# EAGLE design transfer (EAGLE 7.4.0)
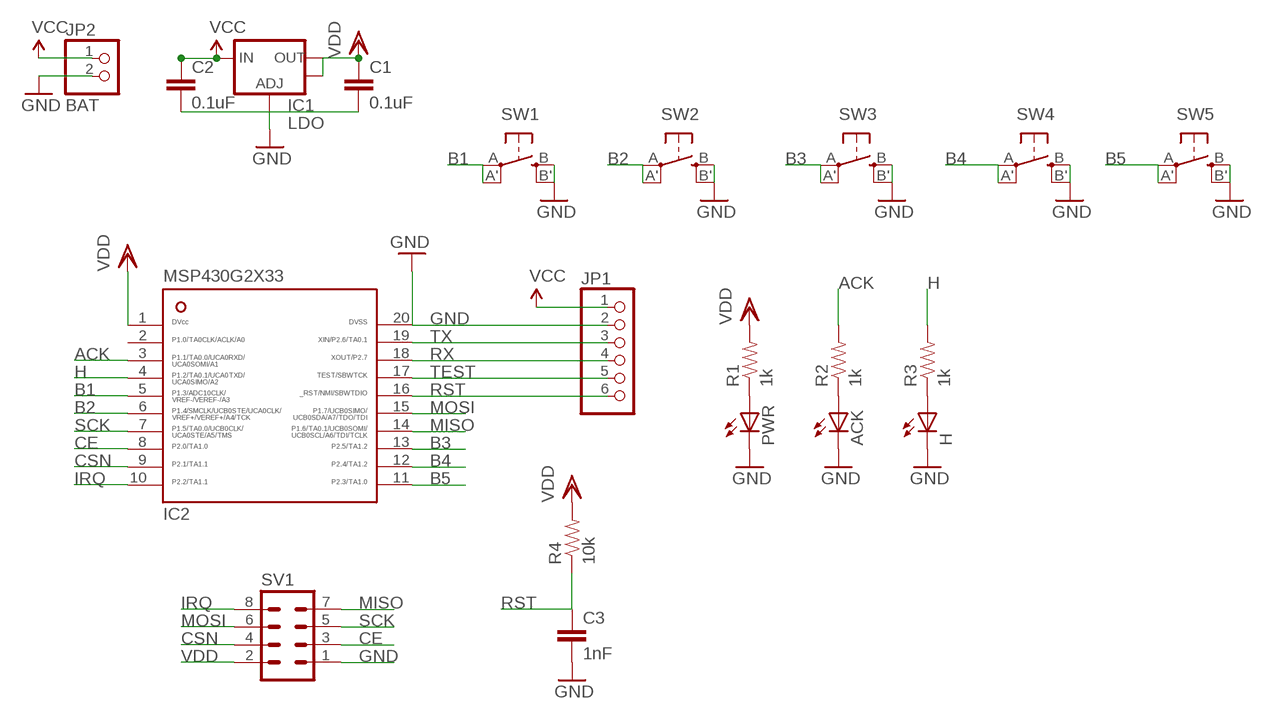
[diagram p0: schematic, sheet 1]

## Parts
ACK  LEDCHIP-LED0805  [CHIP-LED0805]
C1  0.1uF  0.1UF-25V(+80/-20%)(0603)  [0603-CAP]
C2  0.1uF  0.1UF-25V(+80/-20%)(0603)  [0603-CAP]
C3  1nF  0.1UF-25V(+80/-20%)(0603)  [0603-CAP]
H  LEDCHIP-LED0805  [CHIP-LED0805]
IC1  LDO  V_REG_LM1117SOT223  [SOT223]
IC2  MSP430  MSP430G2X33-20PW20  [PW20]
JP1  PINHD-1X6  [1X06]
JP2  BAT  PINHD-1X2  [1X02]
PWR  LEDCHIP-LED0805  [CHIP-LED0805]
R1  1k  0.22OHM1/4W1%(0805)  [0805]
R2  1k  0.22OHM1/4W1%(0805)  [0805]
R3  1k  0.22OHM1/4W1%(0805)  [0805]
R4  10k  0.22OHM1/4W1%(0805)  [0805]
SV1  MA04-2  [MA04-2]
SW1  SPST_TACT-EVQQ2  [EVQ-Q2]
SW2  SPST_TACT-EVQQ2  [EVQ-Q2]
SW3  SPST_TACT-EVQQ2  [EVQ-Q2]
SW4  SPST_TACT-EVQQ2  [EVQ-Q2]
SW5  SPST_TACT-EVQQ2  [EVQ-Q2]

## Nets
ACK: IC2.3 R2.2
B1: IC2.5 SW1.A'(P1) SW1.A(P)
B2: IC2.6 SW2.A'(P1) SW2.A(P)
B3: IC2.13 SW3.A'(P1) SW3.A(P)
B4: IC2.12 SW4.A'(P1) SW4.A(P)
B5: IC2.11 SW5.A'(P1) SW5.A(P)
CE: IC2.8 SV1.3
CSN: IC2.9 SV1.4
GND: ACK.C C1.2 C2.2 C3.2 H.C IC1.1(ADJ) IC2.20 JP1.2 JP2.2 PWR.C SV1.1 SW1.B'(S1) SW1.B(S) SW2.B'(S1) SW2.B(S) SW3.B'(S1) SW3.B(S) SW4.B'(S1) SW4.B(S) SW5.B'(S1) SW5.B(S)
H: IC2.4 R3.2
IRQ: IC2.10 SV1.8
MISO: IC2.14 SV1.7
MOSI: IC2.15 SV1.6
N$6: PWR.A R1.1
N$7: ACK.A R2.1
N$8: H.A R3.1
RST: C3.1 IC2.16 JP1.6 R4.1
RX: IC2.18 JP1.4
SCK: IC2.7 SV1.5
TEST: IC2.17 JP1.5
TX: IC2.19 JP1.3
VCC: C2.1 IC1.3(IN) JP1.1 JP2.1
VDD: C1.1 IC1.2(OUT) IC1.4(OUT) IC2.1 R1.2 R4.2 SV1.2
Unconnected: IC2.2

## Library data of the parts
ACK H PWR = adafruit:LED: LED OSRAM: - CHIPLED LG R971, LG N971, LY N971, LG Q971, LY Q971, LO R971, LY R971 LH N974, LH R974 LS Q976, LO Q976, LY Q976 LO Q996 - Hyper CHIPLED LW Q18S LB Q993, LB Q99A, LB R99A - SideLED LS A670, LO A670, LY A670, LG A670, LP A670 LB A673, LV A673, LT A673, LW A673 LH A674 LY A675 LS A676, LA A676, LO A676, LY A676, LW A676 LS A679, LY A679, LG A679 - Hyper Micro SIDELED® LS Y876, LA Y876, LO Y876, LY Y876 LT Y87S - SmartLED LW L88C, LW L88S LB L89C, LB L89S, LG L890 LS L89K, LO L89K, LY L89K LS L896, LA L896, LO L896, LY L896 - TOPLED LS T670, LO T670, LY T670, LG T670, LP T670 LSG T670, LSP T670, LSY T670, LOP T670, LYG T670 LG T671, LOG T671, LSG T671 LB T673, LV T673, LT T673, LW T673 LH T674 LS T676, LA T676, LO T676, LY T676, LB T676, LH T676, LSB T676, LW T676 LB T67C, LV T67C, LT T67C, LS T67K, LO T67K, LY T67K, LW E67C LS E67B, LA E67B, LO E67B, LY E67B, LB E67C, LV E67C, LT E67C LW T67C LS T679, LY T679, LG T679 LS T770, LO T770, LY T770, LG T770, LP T770 LB T773, LV T773, LT T773, LW T773 LH T774 LS E675, LA E675, LY E675, LS T675 LS T776, LA T776, LO T776, LY T776, LB T776 LHGB T686 LT T68C, LB T68C - Hyper Mini TOPLED® LB M676 - Mini TOPLED Santana® LG M470 LS M47K, LO M47K, LY M47K Source: http://www.osram.convergy.de/
C1 C2 = SparkFun-Capacitors:0.1UF-25V(+80/-20%)(0603): CAP-00810 Ceramic Standard decoupling cap; PROD_ID: CAP-00810
C3 = SparkFun-Capacitors:0.1UF-25V(+80/-20%)(0603): CAP-00810 Ceramic Standard decoupling cap; PROD_ID: CAP-00810; VALUE: 0.1uF
IC1 = SparkFun-PowerIC:V_REG_LM1117: Voltage Regulator LM1117 Standard adjustable voltage regulator but in SMD form. Spark Fun Electronics SKU : COM-00595
IC2 = ti_msp430:MSP430G2X33-20
JP1 = pinhead:PINHD-1X6: PIN HEADER
JP2 = pinhead:PINHD-1X2: PIN HEADER
R1-R4 = SparkFun-Resistors:0.22OHM1/4W1%(0805): RES-09883; PROD_ID: RES-09883; VALUE: 0.22
SV1 = con-lstb:MA04-2: PIN HEADER; OC_FARNELL: unknown; OC_NEWARK: unknown
SW1-SW5 = adafruit:SPST_TACT: SMT 6mm switch, EVQQ2 series http://www.ladyada.net/library/eagle

## Board
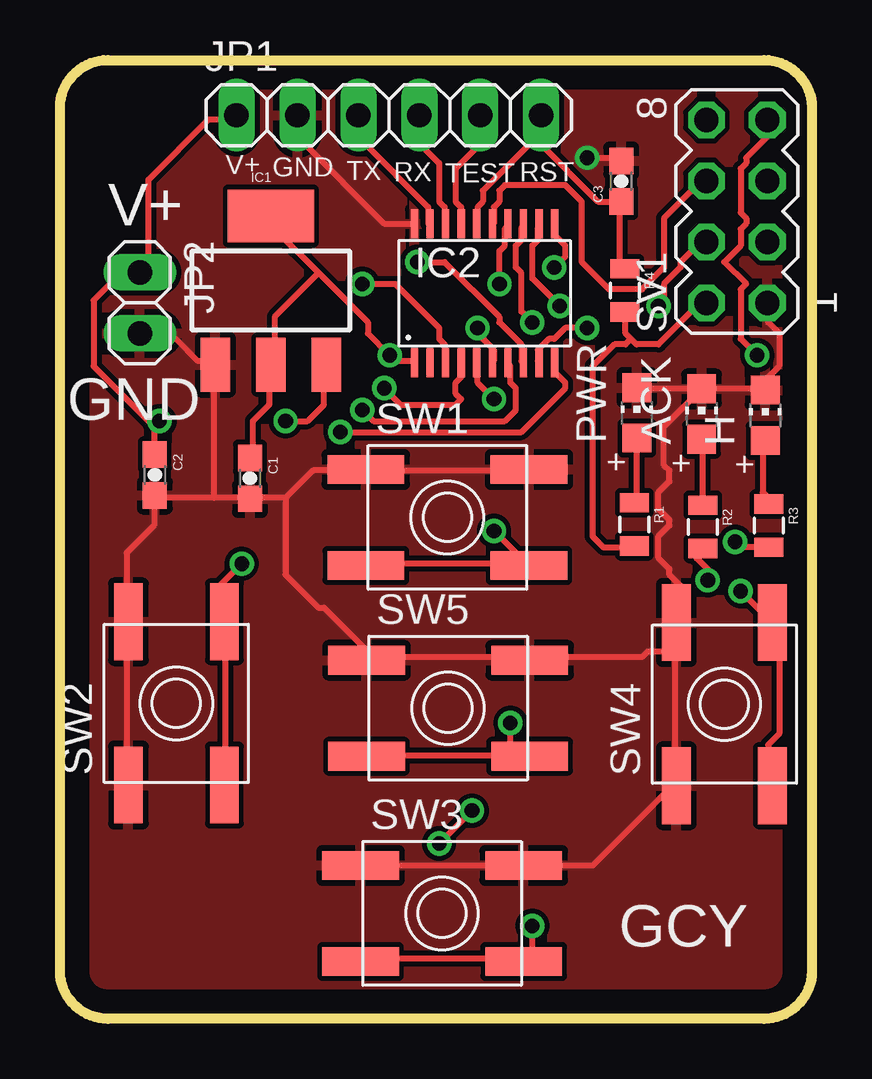
[diagram p1: board, top side]
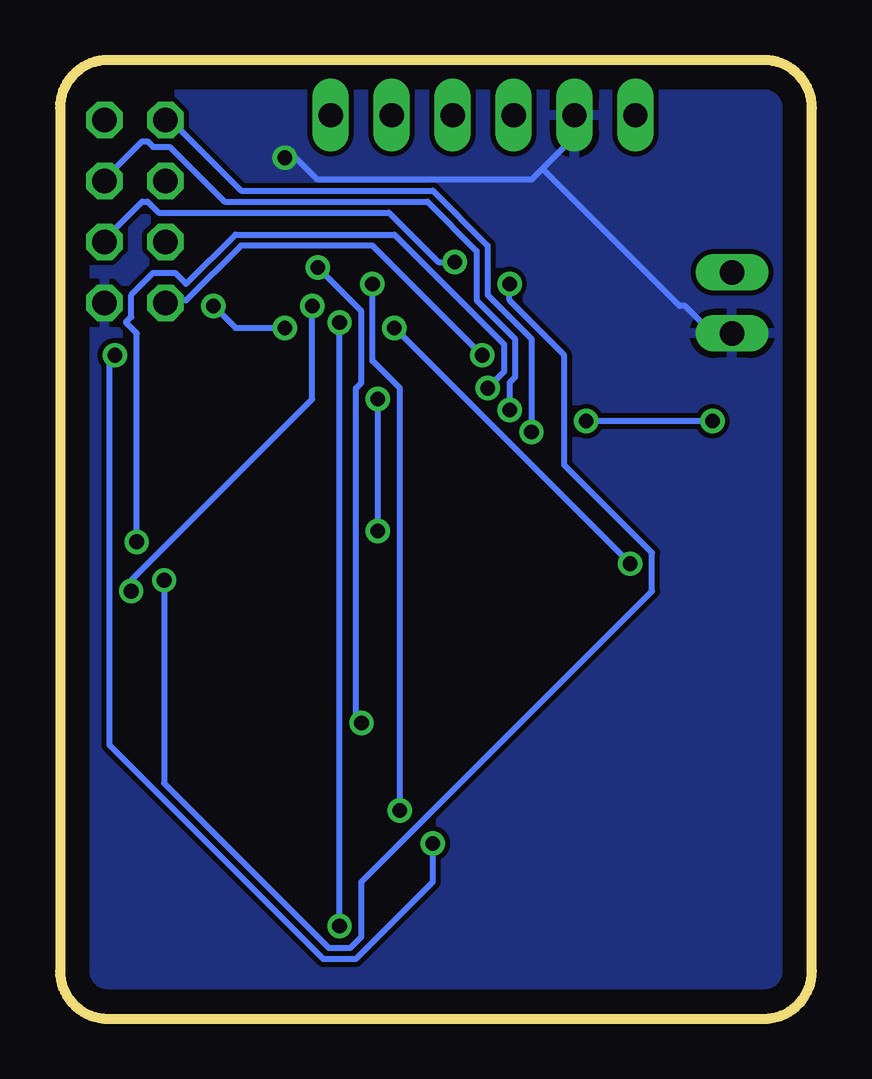
[diagram p2: board, bottom side, seen from below]

Size 31.35 x 39.95 mm. Coordinates in mm from the lower left corner, seen from the top.
Outline: 0,2 0,37.95 arc-90 2,39.95 29.35,39.95 arc-90 31.35,37.95 31.35,2 arc-90 29.35,0 2,0 arc-90 0,2
Copper layers (1*16): Top 0.035mm / dielectric 1.5mm / Bottom 0.035mm
Design rules "default": minimum track width 10mil, minimum drill 24mil, track to track 8mil, track to pad 8mil, pad to pad 8mil, via to via 8mil, smd to smd 8mil, copper to edge 40mil, drill to drill 8mil, minimum pad ring 10mil, minimum via ring 8mil, stop-mask expansion 4mil, vias tented up to drill 0mil, thermal gap 10mil

### Footprints (pad centres in the part's own frame; a part is rotated, then mirrored left to right if it is on the bottom)
CHIP-LED0805 = smd 1.2 x 1.2: A 0,-1.05; C 0,1.05
0603-CAP = smd 1.1 x 1: 1 -0.85,0; 2 0.85,0
SOT223 = smd 1.219 x 2.235: 1 -2.311,-3.099; 2 0,-3.099; 3 2.311,-3.099 | smd 3.6 x 2.2: 4 0,3.099
PW20 = smd 0.3 x 1.2: 1 -2.925,-2.9; 2 -2.275,-2.9; 3 -1.625,-2.9; 4 -0.975,-2.9; 5 -0.325,-2.9; 6 0.325,-2.9; 7 0.975,-2.9; 8 1.625,-2.9; 9 2.275,-2.9; 10 2.925,-2.9; 11 2.925,2.9; 12 2.275,2.9; 13 1.625,2.9; 14 0.975,2.9; 15 0.325,2.9; 16 -0.325,2.9; 17 -0.975,2.9; 18 -1.625,2.9; 19 -2.275,2.9; 20 -2.925,2.9
1X06 = drill 1.016 long: 1 -6.35,0; 2 -3.81,0; 3 -1.27,0; 4 1.27,0; 5 3.81,0; 6 6.35,0
1X02 = drill 1.016 long: 1 -1.27,0; 2 1.27,0
0805 = smd 0.8 x 1.2: 1 -0.9,0; 2 0.9,0
MA04-2 = drill 1.016 octagon: 1 -3.81,-1.27; 2 -3.81,1.27; 3 -1.27,-1.27; 4 -1.27,1.27; 5 1.27,-1.27; 6 1.27,1.27; 7 3.81,-1.27; 8 3.81,1.27
EVQ-Q2 = smd 3.2 x 1.2: A -3.4,-2; A' 3.4,-2; B -3.4,2; B' 3.4,2

### Placement (x,y rotation side)
ACK  26.75,25.2 0 top
C1  7.92,22.52 270 top
C2  3.95,22.66 270 top
C3  23.4,34.9 90 top
H  29.4,25.15 0 top
IC1  8.79,30.35 0 top
IC2  17.7,30.23 0 top
JP1  13.71,37.65 0 top
JP2  3.33,29.83 270 top
PWR  24.05,25.25 0 top
R1  23.95,20.6 270 top
R2  26.8,20.5 270 top
R3  29.55,20.55 270 top
R4  23.55,30.35 270 top
SV1  28.22,33.64 90 top
SW1  16.15,20.89 0 top
SW2  4.85,13.14 90 top
SW3  15.93,4.39 0 top
SW4  27.7,13.11 90 top
SW5  16.18,12.94 0 top

### Tracks (layer width: path | path; a pad name or v marks a point on that pad's centre or on a via)
ACK  (via drill 0.61)
  Top 0.254: v12.61,30.62 13.98,30.62 15.81,28.79 15.81,28.33 16.03,28.1 16.03,27.42 IC2.3 | v27.01,18.27 27.24,18.5 26.55,19.19 26.55,19.42 26.78,19.65 R2.2
  Bottom 0.254: v12.61,30.62 12.61,29.93 10.32,27.65 10.32,23.07 6.66,19.42 6.66,17.82 18.78,5.7 18.78,3.41 19.24,2.96 20.15,2.96 27.01,9.82 v27.01,18.27
B1  (via drill 0.61)
  Top 0.254: v18.09,25.82 17.41,26.5 17.41,27.19 IC2.5 | 19.01,19.42 19.46,18.96 SW1.A' 19.01,19.42 | 19.01,19.42 v18.09,20.33 | 19.01,19.42 18.55,18.96 12.84,18.96 SW1.A
  Bottom 0.254: v18.09,20.33 v18.09,25.82
B2  (via drill 0.61)
  Top 0.254: v17.41,28.79 17.63,28.56 17.63,28.33 18.09,27.88 18.09,27.42 IC2.6 | v7.58,18.96 6.66,18.05 6.66,16.67 SW2.A' 6.89,16.45 6.89,9.82 SW2.A
  Bottom 0.254: v7.58,18.96 v17.41,28.79
B3  (via drill 0.61)
  Top 0.254: v19.69,29.02 19.24,29.48 19.24,31.08 19.01,31.3 19.01,32.22 19.24,32.45 19.24,32.91 IC2.13 | v19.69,3.87 19.69,2.73 19.46,2.5 SW3.A' 19.24,2.5 12.61,2.5 SW3.A
  Bottom 0.254: v19.69,3.87 v19.69,29.02
B4  (via drill 0.61)
  Top 0.254: v20.84,29.7 19.69,30.85 19.69,32.22 19.92,32.45 19.92,32.91 IC2.12 | v28.38,17.82 29.52,16.67 SW4.A' 29.75,16.45 29.98,16.22 29.98,11.87 29.52,11.42 29.52,9.82 SW4.A
  Bottom 0.254: v20.84,29.7 20.84,25.82 28.38,18.27 v28.38,17.82
B5  (via drill 0.61)
  Top 0.254: v20.61,31.3 21.06,31.76 21.06,32.22 20.61,32.68 20.61,32.91 IC2.11 | 18.78,11.42 v18.78,12.33 | 18.78,11.42 19.46,10.73 SW5.A' 18.78,11.42 | 18.78,11.42 18.32,10.96 12.84,10.96 SW5.A
  Bottom 0.254: v20.61,31.3 18.78,29.48 18.78,26.5 19.01,26.27 19.01,12.56 v18.78,12.33
CE  (via drill 0.61)
  Top 0.254: v14.89,31.53 16.03,31.53 18.32,29.25 18.32,29.02 19.24,28.1 19.24,27.42 IC2.8
  Bottom 0.254: v14.89,31.53 15.58,31.53 17.63,33.59 27.24,33.59 27.69,34.05 27.92,34.05 29.52,32.45 SV1.3
CSN  (via drill 0.61)
  Top 0.254: v21.98,28.79 21.06,28.79 20.61,28.33 20.38,28.33 19.92,27.88 19.92,27.42 IC2.9 | v24.95,29.7 25.18,29.93 25.18,30.62 25.87,31.3 25.87,31.53 26.78,32.45 SV1.4
  Bottom 0.254: v21.98,28.79 24.04,28.79 v24.95,29.7
GND  (via drill 0.61)
  Top 0.254: SW3.B 12.61,6.39 19.24,6.39 SW3.B' 19.46,6.39 22.21,6.39 25.64,9.82 | ACK.C 26.55,26.27 24.27,26.27 PWR.C | ACK.C 26.78,26.27 29.29,26.27 H.C 29.52,26.27 29.52,26.73 29.98,27.19 29.98,28.56 29.52,29.02 29.52,29.7 SV1.1 | 25.64,15.3 25.64,16.45 SW4.B' | 25.64,15.3 25.64,9.82 | ACK.C 26.55,26.05 25.18,24.68 25.18,23.07 25.41,22.85 25.41,22.39 24.95,21.93 24.95,21.25 25.41,20.79 25.41,20.56 24.95,20.1 24.95,19.19 25.41,18.73 25.41,18.5 25.87,18.05 25.87,16.67 SW4.B' | 25.64,9.82 SW4.B | 25.64,15.3 24.49,15.3 24.27,15.07 19.69,15.07 SW5.B' 19.46,15.07 12.84,15.07 SW5.B 12.61,15.07 12.61,15.53 11.01,17.13 10.78,17.13 9.41,18.5 9.41,21.7 | 25.64,15.3 SW4.B' | v21.98,35.88 23.35,35.88 C3.2 | IC2.20 14.66,33.13 13.52,33.13 10.09,36.56 10.09,37.48 JP1.2 | SW2.B 2.78,9.82 2.78,16.45 SW2.B' 2.78,16.67 2.78,19.42 3.92,20.56 3.92,21.7 C2.2 4.15,21.7 6.43,21.7 | JP2.2 3.46,28.33 4.83,28.33 5.75,27.42 6.43,27.42 IC1.1 6.43,27.19 6.43,21.7 | 6.43,21.7 7.81,21.7 C1.2 8.03,21.7 9.41,21.7 | 9.41,21.7 10.55,22.85 12.61,22.85 SW1.B 12.84,22.85 19.46,22.85 SW1.B'
  Bottom 0.254: v21.98,35.88 21.52,35.88 20.61,34.96 11.69,34.96 11.23,35.42 | 11.23,35.42 10.09,36.56 10.09,37.48 JP1.2 | 11.23,35.42 5.52,29.7 5.29,29.7 4.15,28.56 3.46,28.56 JP2.2
  pour Bottom: 1.7,39.9 29.4,39.9 arc-90 31.4,37.9 31.4,2.2 31.4,2 arc-90 29.4,0 2.2,0 2,0 arc-90 0,2 0,38.2 arc-90
  pour Top: -0.05,1.9 arc90 1.95,-0.1 29.1,-0.1 29.35,-0.1 arc90 31.35,1.9 31.35,38.1 arc90 29.5,39.95 2.2,39.95 1.9,39.95 arc90 0,38.1 0,38.25
H  (via drill 0.61)
  Top 0.254: v13.52,26.27 14.21,25.59 16.49,25.59 16.72,25.82 16.49,26.05 16.49,26.5 16.72,26.73 16.72,27.19 IC2.4 | v28.15,19.88 28.38,19.65 29.52,19.65 R3.2
  Bottom 0.254: v13.52,26.27 12.84,26.96 12.84,28.1 17.41,32.68 24.04,32.68 26.09,30.62 26.55,31.08 27.47,31.08 28.38,30.16 28.38,29.25 28.61,29.02 28.15,28.56 v28.15,19.88
IRQ  (via drill 0.61)
  Top 0.254: v11.69,24.45 19.24,24.45 21.06,26.27 21.06,26.5 20.61,26.96 20.61,27.19 IC2.10
  Bottom 0.254: v11.69,24.45 11.69,28.33 13.52,30.16 13.52,32.22 15.81,34.51 23.81,34.51 26.78,37.48 SV1.8
MISO  (via drill 0.61)
  Top 0.254: v18.32,30.62 18.32,31.99 18.55,32.22 18.55,32.91 IC2.14 | v15.81,7.3 v17.18,8.67 | v29.06,27.65 28.38,28.33 28.38,30.39 28.61,30.62 27.69,31.53 28.38,32.22 28.38,32.91 28.61,33.13 28.61,33.36 28.38,33.59 28.38,35.42 28.61,35.65 28.61,35.88 29.52,36.79 29.52,37.25 SV1.7
  Bottom 0.254: v18.32,30.62 18.32,27.42 17.18,26.27 v17.18,8.67 | v15.81,7.3 15.81,5.7 19.01,2.5 20.38,2.5 29.29,11.42 29.29,27.42 v29.06,27.65
MOSI
  Top 0.254: IC2.15 18.09,33.13 18.09,33.82 18.32,34.05 18.32,34.51 18.55,34.73 21.06,34.73 21.75,34.05 21.75,31.53 22.89,30.39 24.27,30.39 25.18,31.3 25.18,33.36 26.78,34.96 SV1.6
N$6
  Top 0.254: R1.1 24.04,21.7 24.04,23.99 PWR.A
N$7
  Top 0.254: R2.1 26.78,21.48 26.78,23.99 ACK.A
N$8
  Top 0.254: R3.1 29.52,21.48 29.52,21.7 29.29,21.93 29.29,23.99 H.A
RST
  Top 0.254: 23.35,34.05 23.35,31.3 R4.1 | 19.69,36.56 19.92,36.79 19.92,37.48 JP1.6 19.69,36.56 | 19.69,36.56 17.63,34.51 17.63,34.05 17.41,33.82 17.41,33.13 IC2.16 | 23.35,34.05 22.44,34.05 19.92,36.56 19.69,36.56 | 23.35,34.05 C3.1
RX
  Top 0.254: IC2.18 16.03,33.13 16.03,33.82 15.81,34.05 15.81,35.65 15.12,36.33 15.12,37.48 JP1.4
SCK  (via drill 0.61)
  Top 0.254: v12.61,25.36 13.06,24.9 18.55,24.9 19.01,25.36 19.01,26.27 18.78,26.5 18.78,27.19 IC2.7
  Bottom 0.254: v12.61,25.36 12.61,26.5 12.38,26.73 12.38,28.33 13.98,29.93 13.98,31.99 16.03,34.05 24.49,34.05 26.78,36.33 27.47,36.33 27.69,36.56 27.92,36.56 29.52,34.96 SV1.5
TEST
  Top 0.254: IC2.17 16.72,33.82 16.49,34.05 16.49,35.42 17.41,36.33 17.41,37.48 JP1.5
TX
  Top 0.254: IC2.19 15.35,33.13 15.35,33.82 12.61,36.56 12.61,37.48 JP1.3
VCC  (via drill 0.61)
  Top 0.254: 3.92,24.68 3.92,23.53 C2.1 | 3.92,24.68 1.41,27.19 1.41,29.93 2.55,31.08 3.23,31.08 JP2.1 3.46,31.3 3.69,31.53 3.69,34.96 6.2,37.48 7.35,37.48 JP1.1 | v9.41,24.9 10.32,24.9 11.01,25.59 11.01,27.19 IC1.3 | 3.92,24.68 v4.15,24.9
  Bottom 0.254: v4.15,24.9 v9.41,24.9
VDD  (via drill 0.61)
  Top 0.254: 23.81,28.33 24.04,28.1 24.95,28.1 26.78,29.93 SV1.2 | 23.81,28.33 23.58,28.56 23.58,29.25 R4.2 | 23.81,28.33 23.58,28.1 23.12,28.1 22.21,27.19 22.21,20.1 22.66,19.65 23.81,19.65 R1.2 | C1.1 8.03,23.53 8.03,24.9 8.72,25.59 8.72,27.19 IC1.2 8.95,27.42 8.95,29.25 10.78,31.08 | 10.78,31.08 8.95,32.91 8.95,33.36 IC1.4 | 10.78,31.08 12.84,29.02 12.84,28.56 v13.75,27.65 13.98,27.42 14.66,27.42 IC2.1
  Bottom 0.254: v13.75,27.65 18.32,32.22 23.81,32.22 26.09,29.93 26.78,29.93 SV1.2

### Text on the board
tPlace: V+ | GND | TX | RX | TEST | RST | V+ | GND | GCY